# Altium schematic sheet design_20.SchDoc: design
size 414 x 279 mm; Date: 1/25/2021 11:39:22 PM; SheetNumber: 21; Origin: Eagle; GateName_1: G$1; SymbolName_1: A3-L-GUMSTIX; LibraryName: qualified_1; DeviceSetName: A3-L-GUMSTIX; A: A; B: B; C: C; D: D; E: E; F: F; G: G; H: H; 1: 1; 2: 2; 3: 3; 4: 4; 5: 5; Sheet: Sheet:; C:/Gumstix/gumstix-logo-16.bmp: C:/Gumstix/gumstix-logo-16.bmp; Board: Board:
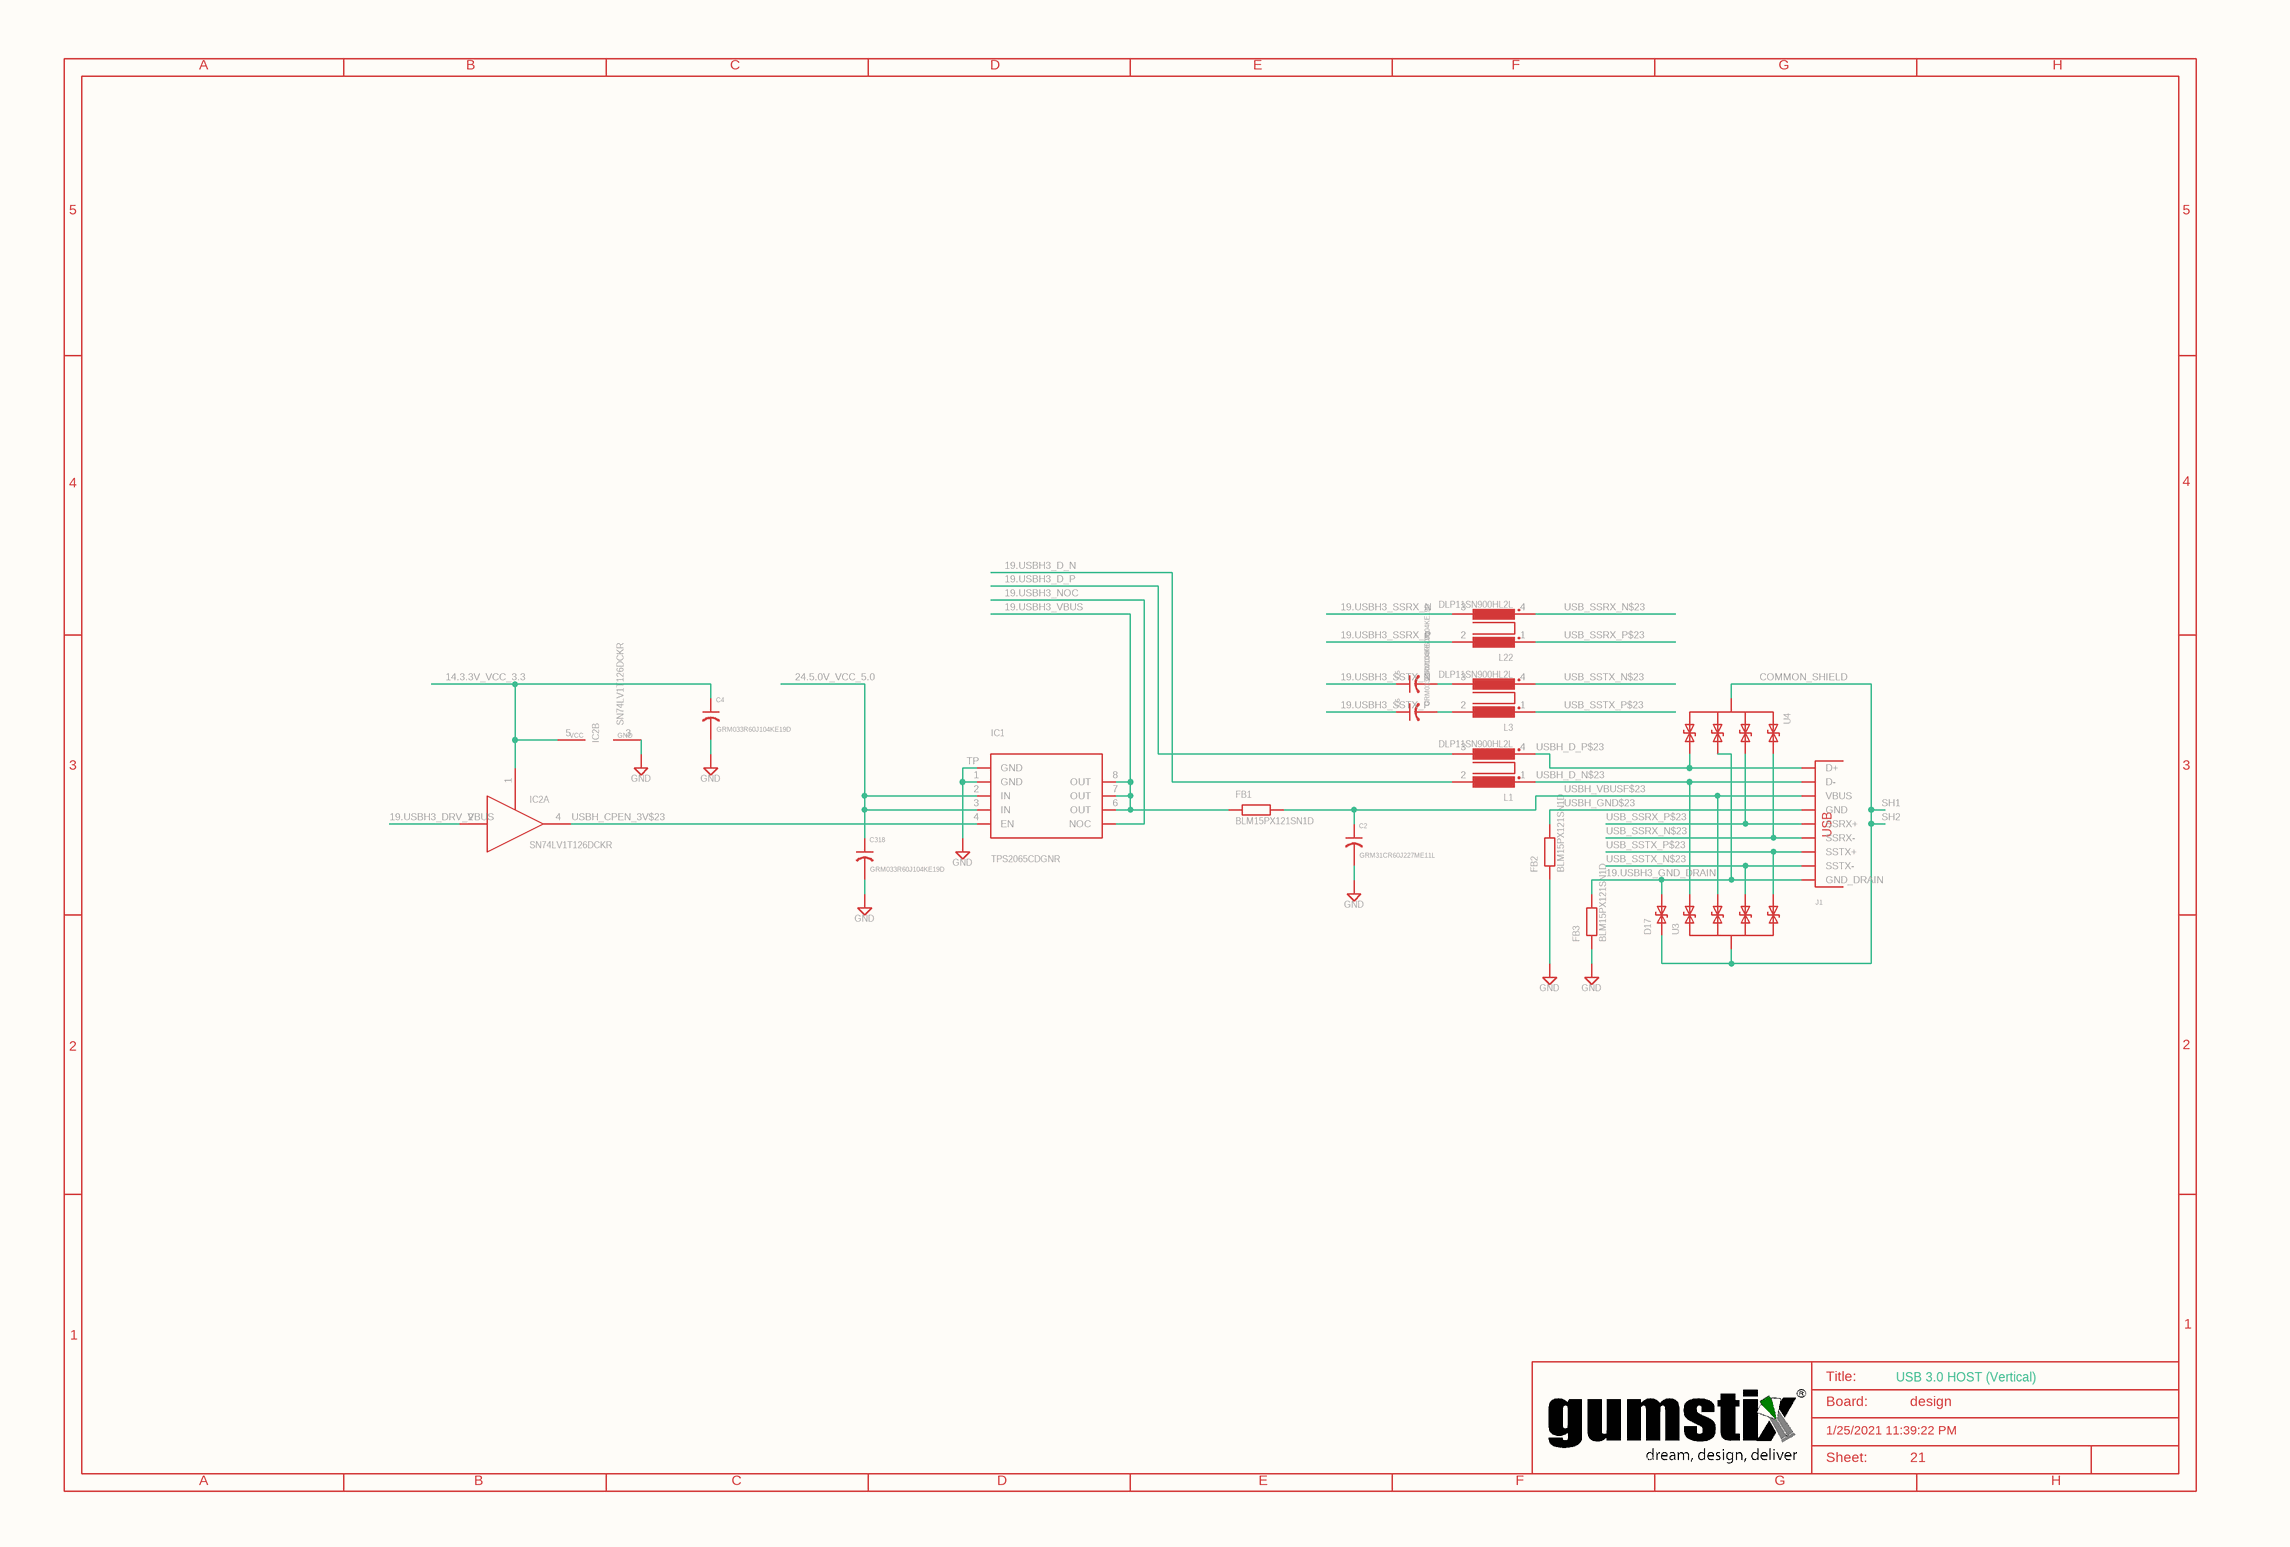
[diagram p0: design_20.SchDoc]

## Parts
C2  GRM31CR60J227ME11L  [1206]
C4  GRM033R60J104KE19D  [0201]
C5  GRM033R60J104KE19D  [0201]
C6  GRM033R60J104KE19D  [0201]
C318  GRM033R60J104KE19D  [0201]
D17  PS04LTVA1  [D0402]  (value not drawn)
FB1  BLM15PX121SN1D  [0402]
FB2  BLM15PX121SN1D  [0402]
FB3  BLM15PX121SN1D  [0402]
IC1  TPS2065CDGNR  [MSOP8-PAD]
IC2  SN74LV1T126DCKR  [SC70-5]  (parts A,B of 2)
J1  10117836-002LF  [USB3-A-H-VERT]  (value not drawn)
L1  DLP11SN900HL2L  [0504-DLP11S]
L3  DLP11SN900HL2L  [0504-DLP11S]
L22  DLP11SN900HL2L  [0504-DLP11S]
SUPPLY4  GND
SUPPLY5  GND
SUPPLY6  GND
SUPPLY7  GND
SUPPLY8  GND
SUPPLY9  GND
SUPPLY194  GND
U3  TPD4E02B04DQAR  [UFDFN-10]  (value not drawn)
U4  TPD4E02B04DQAR  [UFDFN-10]  (value not drawn)

## Nets
14.3.3V_VCC_3.3: C4.1 IC2.1(OE) IC2.5(VCC)
19.USBH3_D_N: L1.2
19.USBH3_D_P: L1.3
19.USBH3_DRV_VBUS: IC2.2(I)
19.USBH3_GND_DRAIN: D17.P2 FB3.2 J1.DRAIN(GND_DRAIN) U4.4_7(P3)
19.USBH3_NOC: IC1.5(NOC)
19.USBH3_SSRX_N: L22.3
19.USBH3_SSRX_P: L22.2
19.USBH3_SSTX_N: C5.1
19.USBH3_SSTX_P: C6.1
19.USBH3_VBUS: FB1.1 IC1.6(OUT) IC1.7(OUT) IC1.8(OUT)
24.5.0V_VCC_5.0: C318.1 IC1.2(IN) IC1.3(IN)
COMMON_SHIELD: D17.P1 J1.SH1 J1.SH2 U3.3_8(SHIELD) U4.3_8(SHIELD)
USB_SSRX_N$23: J1.SSRX- L22.4 U4.1_10(P1)
USB_SSRX_P$23: J1.SSRX+ L22.1 U4.2_9(P2)
USB_SSTX_N$23: J1.SSTX- L3.4 U3.4_7(P3)
USB_SSTX_P$23: J1.SSTX+ L3.1 U3.5_6(P4)
USBH_CPEN_3V$23: IC1.4(EN) IC2.4(O)
USBH_D_N$23: J1.D- L1.1 U3.1_10(P1)
USBH_D_P$23: J1.D+ L1.4 U4.5_6(P4)
USBH_GND$23: FB2.2 J1.GND
USBH_VBUSF$23: C2.1 FB1.2 J1.VBUS U3.2_9(P2)
NetC2_2: C2.2 SUPPLY8.?1(GND)
NetC4_2: C4.2 SUPPLY7.?1(GND)
NetC5_2: C5.2 L3.3
NetC6_2: C6.2 L3.2
NetC318_2: C318.2 SUPPLY4.?1(GND)
NetFB2_1: FB2.1 SUPPLY194.?1(GND)
NetFB3_1: FB3.1 SUPPLY9.?1(GND)
NetIC1_1: IC1.1(GND) IC1.TP(GND) SUPPLY5.?1(GND)
NetIC2_3: IC2.3(GND) SUPPLY6.?1(GND)

## Notes on the sheet
- A
- B
- C
- D
- E
- F
- G
- H
- 5
- 4
- 3
- 2
- 1
- Title:
- Board:
- USB 3.0 HOST (Vertical)
- design
- C:/Gumstix/gumstix-logo-16.bmp
- 1/25/2021 11:39:22 PM
- Sheet:
- 21

## Library data of the parts
C2 = GRM31CR60J227ME11L: GateName_1: G$1; SymbolName_1: C-US; LibraryName: qualified_1@eagle_src_repo_0b5741b5d4abbb92614c593c71c49b300549e5ff; DeviceSetName: GRM31CR60J227ME11L; DM: DM; DR: DR; DX: DX; DY: DY; HEIGHT: 0.51; SHEETNO: SHEETNO
C4-C6 C318 = GRM033R60J104KE19D: GateName_1: G$1; SymbolName_1: C-US; LibraryName: qualified_1@eagle_src_repo_0b5741b5d4abbb92614c593c71c49b300549e5ff; DeviceSetName: GRM033R60J104KE19D; HEIGHT: 0.25
  C318: DM: DM; DR: DR; DX: DX; DY: DY; SHEETNO: SHEETNO
D17 = PS04LTVA1: GateName_1: G$1; SymbolName_1: ESD-DIODE; LibraryName: qualified_1; DeviceSetName: PS04LTVA1; HEIGHT: 0.35
FB1-FB3 = BLM15PX121SN1D: GateName_1: G$1; SymbolName_1: FB; LibraryName: qualified_1@eagle_src_repo_0b5741b5d4abbb92614c593c71c49b300549e5ff; DeviceSetName: BLM15PX121SN1D; DM: DM; DR: DR; DX: DX; DY: DY; HEIGHT: 0.35; SHEETNO: SHEETNO
IC1 = TPS2065CDGNR: GateName_1: G$1; SymbolName_1: TPS2051; LibraryName: qualified_1; DeviceSetName: TPS2065CDGNR; HEIGHT: 1.1
IC2 = SN74LV1T126DCKR: Single Bus Buffer Gate With 3-State Outputs; GateName_1: A; SymbolName_1: 74126; GateName_2: P; SymbolName_2: PWRN; LibraryName: qualified_1; DeviceSetName: SN74LV1T126DCKR; HEIGHT: 1.1
J1 = 10117836-002LF: USB 3.0 Host A; GateName_1: G$1; SymbolName_1: USB3-H; LibraryName: qualified_1; DeviceSetName: 10117836-002LF; USB: USB
L1 L3 L22 = DLP11SN900HL2L: GateName_1: G$1; SymbolName_1: COM_MODE_CHOKE_DLP; LibraryName: qualified_1@eagle_src_repo_0b5741b5d4abbb92614c593c71c49b300549e5ff; DeviceSetName: DLP11SN900HL2L; HEIGHT: 0.83
SUPPLY4-SUPPLY9 SUPPLY194 = GND: SUPPLY SYMBOL; SymbolName_1: GND-2; GateName_1: GND; LibraryName: qualified_1; DeviceSetName: GND
U3 U4 = TPD4E02B04DQAR: TPD4E02B04 4-Channel ESD Protection Diode for USB Type-C and HDMI 2.0    http://www.ti.com/lit/ds/symlink/tpd4e02b04.pdf; GateName_1: G1; SymbolName_1: ESD-DIODE-4; LibraryName: qualified_1; DeviceSetName: TPD4E02B04DQAR